# EAGLE design DLY_1_0 (EAGLE 8.3.2)
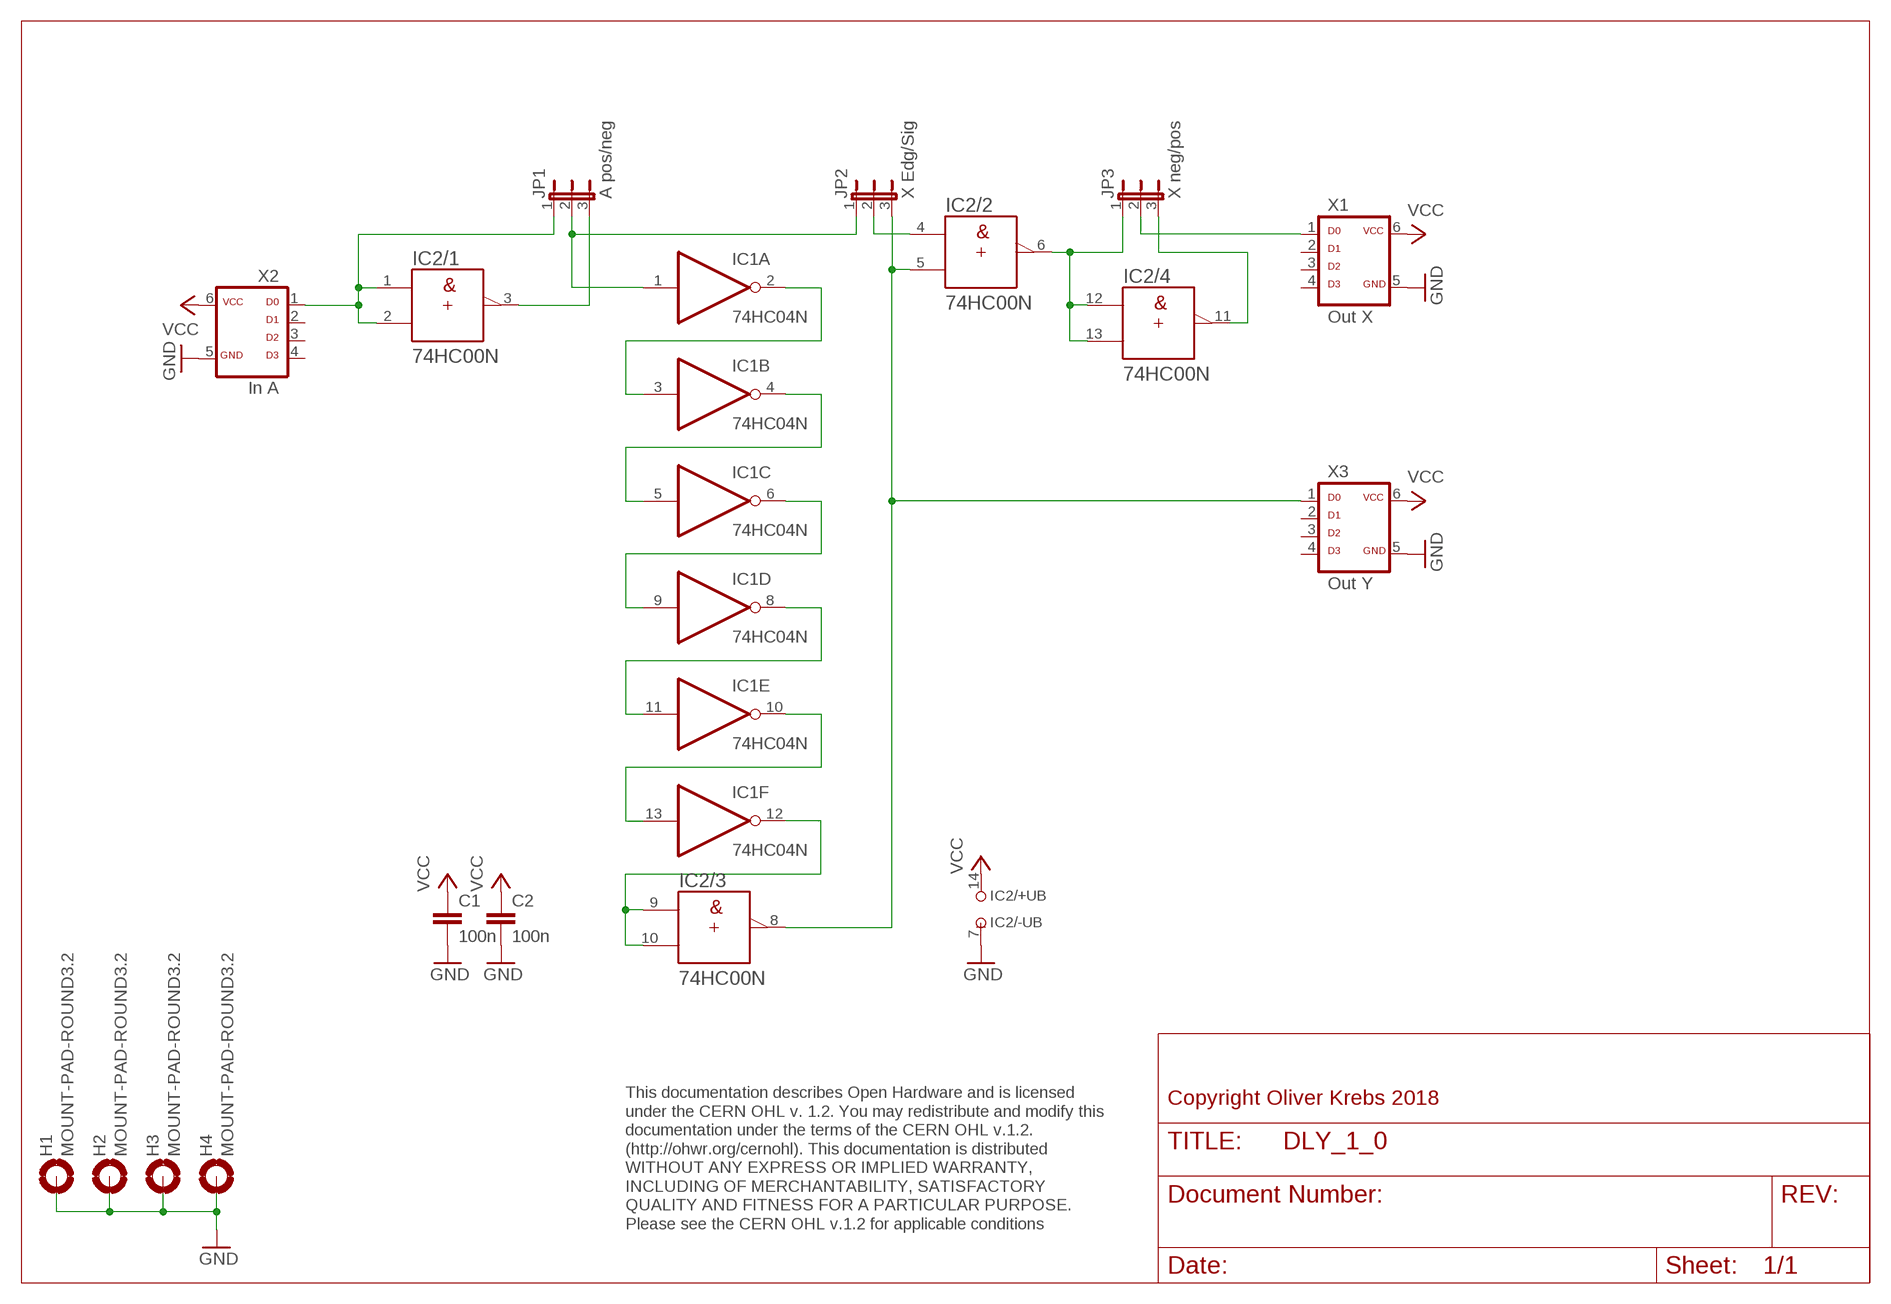
[diagram p0: schematic, sheet 1]

## Parts
C1  100n  C-EU050-025X075  [C050-025X075]
C2  100n  C-EU050-025X075  [C050-025X075]
H1  MOUNT-PAD-ROUND3.2  [3,2-PAD]
H2  MOUNT-PAD-ROUND3.2  [3,2-PAD]
H3  MOUNT-PAD-ROUND3.2  [3,2-PAD]
H4  MOUNT-PAD-ROUND3.2  [3,2-PAD]
IC1  74HC04N  [DIL14]
IC2  74HC00N  [DIL14]
JP1  A pos/neg  JP2EJP2  [JP2]
JP2  X Edg/Sig  JP2EJP2  [JP2]
JP3  X neg/pos  JP2EJP2  [JP2]
X1  Out X  ML6D  [ML-6]
X2  In A  ML6D  [ML-6]
X3  Out Y  ML6D  [ML-6]

## Nets
GND: C1.2 C2.2 H1.B3,2(MOUNT) H2.B3,2(MOUNT) H3.B3,2(MOUNT) H4.B3,2(MOUNT) IC2.7(/-UB:-UB) X1.5 X2.5 X3.5
N$1: IC2.1(/1:A) IC2.2(/1:B) JP1.1 X2.1
N$2: IC1.2(A:O) IC1.3(B:I)
N$3: IC1.4(B:O) IC1.5(C:I)
N$4: IC1.6(C:O) IC1.9(D:I)
N$5: IC1.8(D:O) IC1.11(E:I)
N$6: IC2.5(/2:B) IC2.8(/3:Y) JP2.3 X3.1
N$7: IC2.3(/1:Y) JP1.3
N$8: IC1.1(A:I) JP1.2 JP2.1
N$9: IC2.4(/2:A) JP2.2
N$10: IC1.12(F:O) IC2.9(/3:A) IC2.10(/3:B)
N$11: IC2.6(/2:Y) IC2.12(/4:A) IC2.13(/4:B) JP3.1
N$12: IC2.11(/4:Y) JP3.3
N$13: JP3.2 X1.1
N$15: IC1.10(E:O) IC1.13(F:I)
VCC: C1.1 C2.1 IC2.14(/+UB:+UB) X1.6 X2.6 X3.6
Unconnected: X1.2 X1.3 X1.4 X2.2 X2.3 X2.4 X3.2 X3.3 X3.4

## Notes on the sheet
- Copyright Oliver Krebs 2018
- This documentation describes Open Hardware and is licensed 
  under the CERN OHL v. 1.2. You may redistribute and modify this 
  documentation under the terms of the CERN OHL v.1.2. 
  (http://ohwr.org/cernohl). This documentation is distributed
  WITHOUT ANY EXPRESS OR IMPLIED WARRANTY, 
  INCLUDING OF MERCHANTABILITY, SATISFACTORY 
  QUALITY AND FITNESS FOR A PARTICULAR PURPOSE. 
  Please see the CERN OHL v.1.2 for applicable conditions

## Power pins joined to a net without a drawn wire
GND: IC1.7(P:GND)
VCC: IC1.14(P:VCC)

## Library data of the parts
C1 C2 = 01-my_rcl:C-EU: CAPACITOR, European symbol
H1-H4 = holes:MOUNT-PAD-ROUND: MOUNTING PAD, round
IC1 = 74xx-eu:74*04: Hex INVERTER
IC2 = 74ttl-din:74*00: Quad 2-input NAND gate
JP1-JP3 = 01-my-jumper:JP2E: JUMPER
X1-X3 = 01-my-con:ML6D

## Board
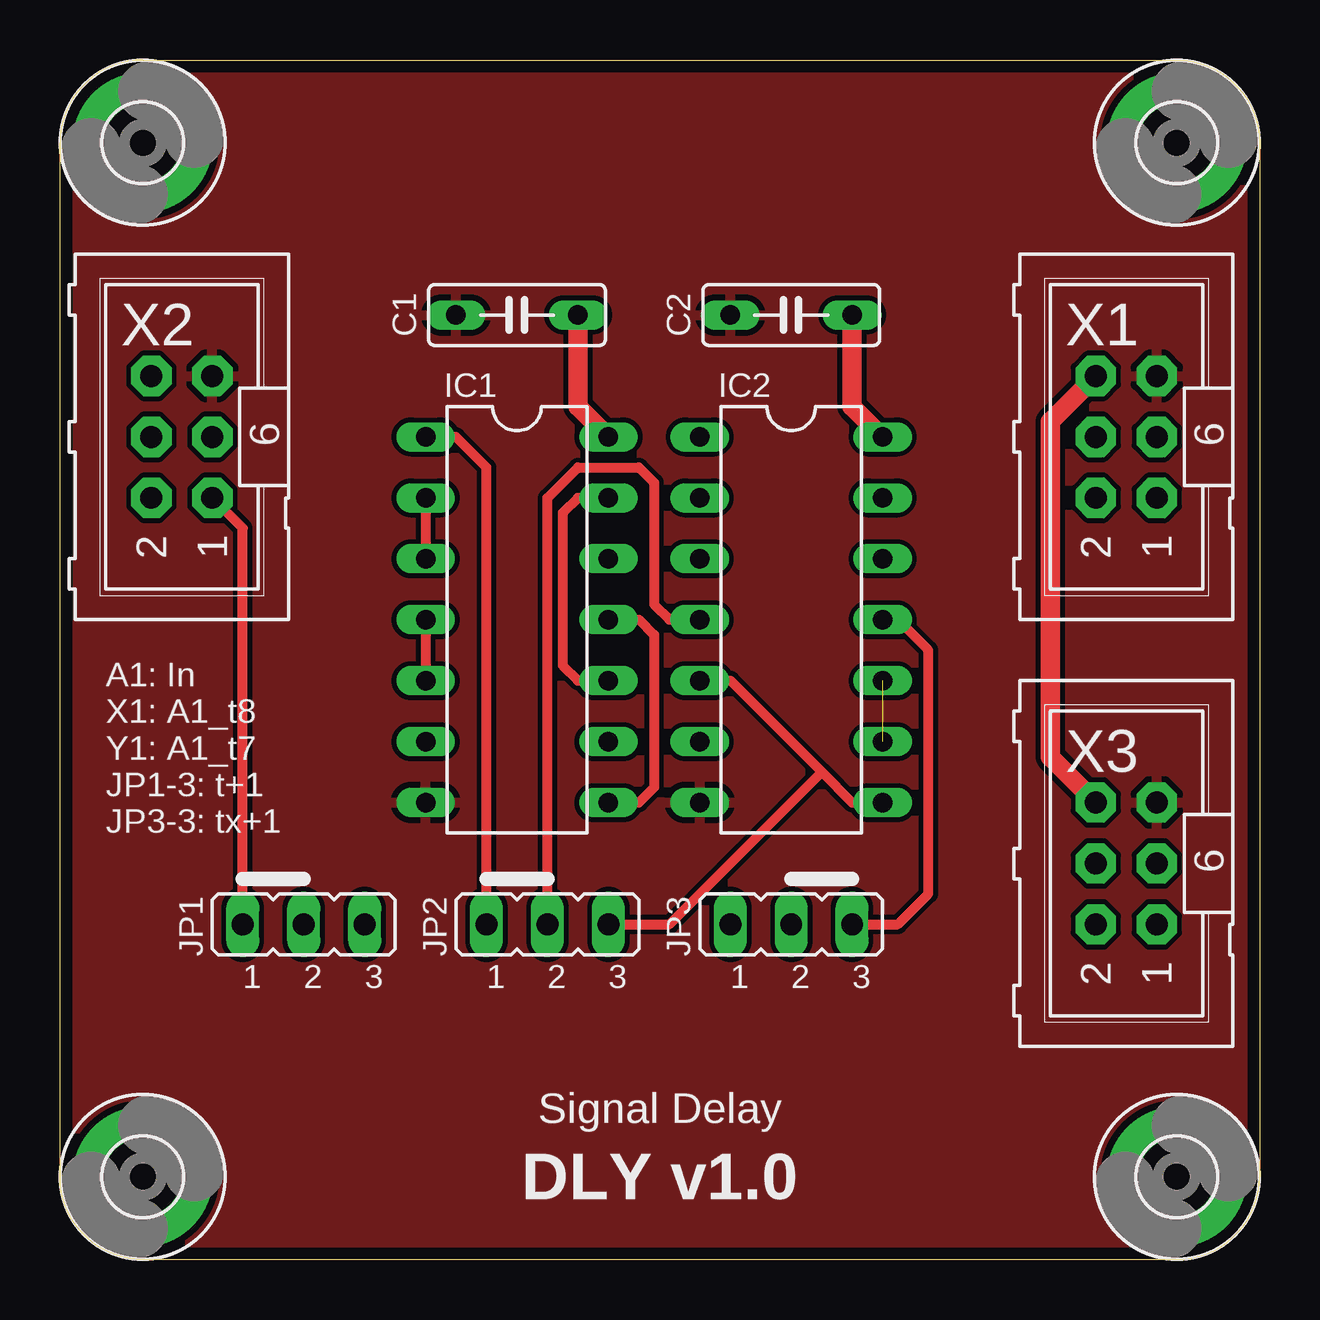
[diagram p1: board, top side]
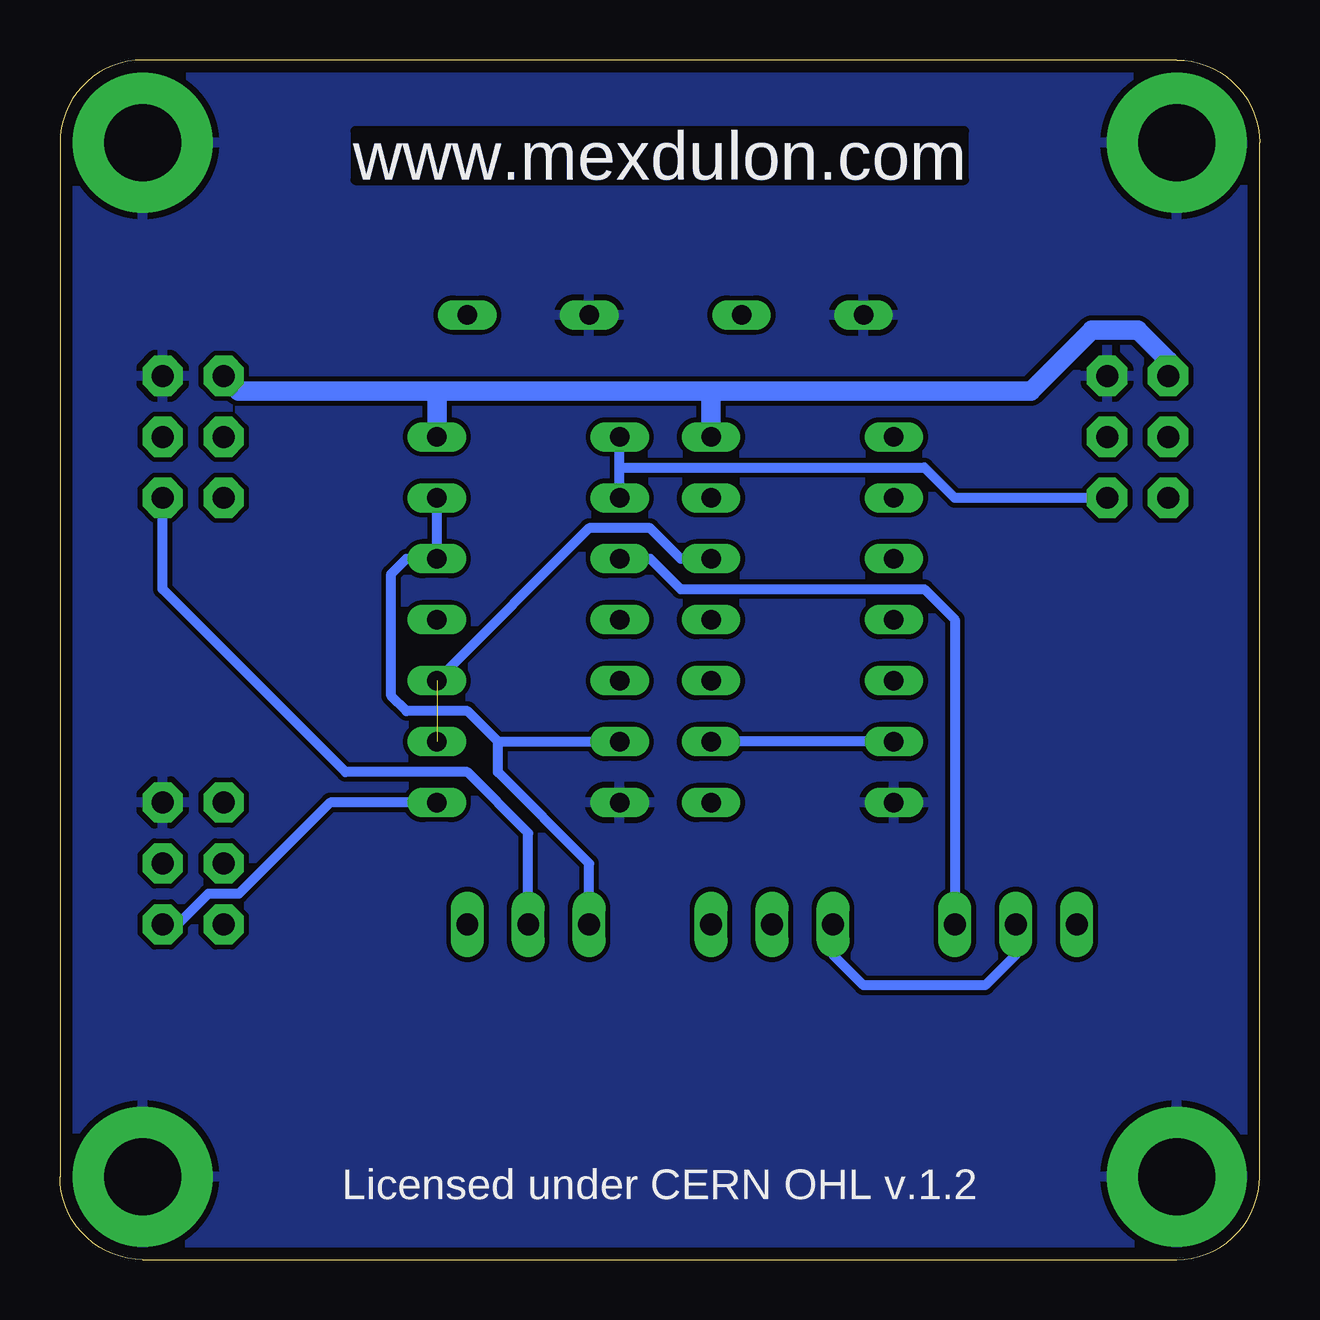
[diagram p2: board, bottom side, seen from below]

Size 50 x 50 mm. Coordinates in mm from the lower left corner, seen from the top.
Outline: 0,3.45 0,46.55 arc-90 3.45,50 46.55,50 arc-90 50,46.55 50,3.45 arc-90 46.55,0 3.45,0 arc-90 0,3.45
Copper layers (1*16): Top 0.035mm / dielectric 1.6mm / Bottom 0.035mm
Design rules "Elecrow_2-layer_PCB_eagle_rule": minimum track width 6mil, minimum drill 12mil, track to track 6mil, track to pad 6mil, pad to pad 6mil, via to via 8mil, smd to smd 0mil, copper to edge 20mil, drill to drill 10mil, minimum pad ring 6mil, minimum via ring 6mil, stop-mask expansion 0mil, vias tented up to drill 100mil, thermal gap 10mil

### Footprints (pad centres in the part's own frame; a part is rotated, then mirrored left to right if it is on the bottom)
C050-025X075 = drill 0.813 long: 1 -2.54,0; 2 2.54,0
3,2-PAD = drill 3.2 pad 5.842: B3,2 0,0
DIL14 = drill 0.813 long: 1 -7.62,-3.81; 2 -5.08,-3.81; 3 -2.54,-3.81; 4 0,-3.81; 5 2.54,-3.81; 6 5.08,-3.81; 7 7.62,-3.81; 8 7.62,3.81; 9 5.08,3.81; 10 2.54,3.81; 11 0,3.81; 12 -2.54,3.81; 13 -5.08,3.81; 14 -7.62,3.81
JP2 = drill 0.914 long: 1 -2.54,0; 2 0,0; 3 2.54,0
ML-6 = drill 0.914 pad 1.676 octagon: 1 -2.54,-1.27; 2 -2.54,1.27; 3 0,-1.27; 4 0,1.27; 5 2.54,-1.27; 6 2.54,1.27

### Placement (x,y rotation side)
C1  19.05,39.37 180 top
C2  30.48,39.37 180 top
H1  3.45,3.45 0 top
H2  3.45,46.55 0 top
H3  46.55,46.55 0 top
H4  46.55,3.45 0 top
IC1  19.05,26.67 270 top
IC2  30.48,26.67 270 top
JP1  10.16,13.97 0 top
JP2  20.32,13.97 0 top
JP3  30.48,13.97 0 top
X1  44.45,34.29 90 top
X2  5.08,34.29 90 top
X3  44.45,16.51 90 top

### Tracks (layer width: path | path; a pad name or v marks a point on that pad's centre or on a via)
GND
  pour Bottom (isolate 0.203): 0,50.16 50.8,50.16 50.8,0 0,0
  pour Top (isolate 0.203): 0,50.16 50.8,50.16 50.8,0 0,0
N$1
  Top 0.406: JP1.1 7.62,30.48 X2.1
  Bottom 0.406: X2.1 12.7,31.75 13.97,33.02 26.67,33.02 | 26.67,33.02 IC2.1 | IC2.2 26.67,33.02
N$2
  Top 0.406: IC1.2 IC1.3
N$3
  Top 0.406: IC1.4 IC1.5
N$4
  Bottom 0.406: IC1.6 IC1.9
N$5
  Top 0.406: IC1.11 24.13,26.67 24.77,26.04 24.77,19.68 24.13,19.05 IC1.8
N$6
  Top 0.406: IC2.5 27.94,24.13 31.75,20.32 | 31.75,20.32 33.02,19.05 IC2.8 | JP2.3 25.4,13.97 31.75,20.32
  Bottom 0.406: IC2.8 38.73,19.05 42.55,15.24 43.81,15.24 45.09,13.97 X3.1
N$7
  Bottom 0.406: IC2.3 25.4,29.21 24.13,27.94 13.97,27.94 12.7,26.67 JP1.3
N$8
  Top 0.406: JP2.1 17.78,33.02 16.51,34.29 IC1.1
  Bottom 0.406: JP1.2 10.16,12.7 11.43,11.43 16.51,11.43 17.78,12.7 JP2.1
N$9
  Top 0.406: JP2.2 20.32,31.75 21.59,33.02 24.13,33.02 24.77,32.38 24.77,27.3 25.4,26.67 IC2.4
N$10  (1 unrouted)
  Bottom 0.406: IC1.12 24.13,29.21 25.4,30.48 27.94,30.48 IC2.10
N$11
  Bottom 0.406: 31.75,21.59 IC2.6 | 31.75,21.59 33.02,22.86 35.56,22.86 36.2,23.5 36.2,28.57 35.56,29.21 IC2.12 IC2.13 | JP3.1 27.94,16.51 31.75,20.32 31.75,21.59
N$12
  Top 0.406: JP3.3 34.92,13.97 36.2,15.24 36.2,25.4 34.92,26.67 IC2.11
N$13
  Bottom 0.406: JP3.2 30.48,17.78 33.02,20.32 38.1,20.32 45.72,27.94 X1.1
N$15
  Top 0.406: IC1.13 21.59,31.75 20.95,31.11 20.95,24.77 21.59,24.13 IC1.10
VCC
  Top 0.813: X1.6 41.27,34.92 41.27,20.95 X3.6 | C1.1 21.59,35.56 IC1.14 | C2.1 33.02,35.56 IC2.14
  Bottom 0.813: X2.6 3.81,37.47 5.08,38.73 6.99,38.73 9.53,36.2 22.86,36.2 | 34.29,36.2 22.86,36.2 | 34.29,36.2 42.55,36.2 X1.6 | IC1.14 22.86,36.2 | IC2.14 34.29,36.2

### Text on the board
Bottom: www.mexdulon.com
tNames: A1: In / X1: A1_t8 / Y1: A1_t7 / JP1-3: t+1 / JP3-3: tx+1 | Signal Delay | DLY v1.0
bNames: www.mexdulon.com | Licensed under CERN OHL v.1.2
200bmp: E:/Bilder/Elektronik/Modulion/Mexdulon/mexdulon_50x50_pcb.bmp